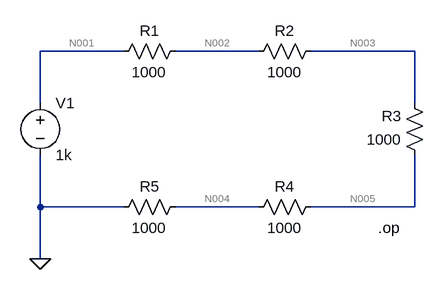
[diagram p0: schematic DC-operating-point.asc]
DC-operating-point.asc, the LTspice schematic file:
Version 4
SHEET 1 880 680
WIRE 192 32 64 32
WIRE 400 32 272 32
WIRE 640 32 480 32
WIRE 64 112 64 32
WIRE 640 112 640 32
WIRE 64 272 64 192
WIRE 192 272 64 272
WIRE 400 272 272 272
WIRE 640 272 640 192
WIRE 640 272 480 272
WIRE 64 352 64 272
FLAG 64 352 0
SYMBOL voltage 64 96 R0
SYMATTR InstName V1
SYMATTR Value 1k
SYMBOL res 288 16 R90
WINDOW 0 0 56 VBottom 2
WINDOW 3 32 56 VTop 2
SYMATTR InstName R1
SYMATTR Value 1000
SYMBOL res 496 16 R90
WINDOW 0 0 56 VBottom 2
WINDOW 3 32 56 VTop 2
SYMATTR InstName R2
SYMATTR Value 1000
SYMBOL res 656 208 R180
WINDOW 0 36 76 Left 2
WINDOW 3 36 40 Left 2
SYMATTR InstName R3
SYMATTR Value 1000
SYMBOL res 384 288 R270
WINDOW 0 32 56 VTop 2
WINDOW 3 0 56 VBottom 2
SYMATTR InstName R4
SYMATTR Value 1000
SYMBOL res 176 288 R270
WINDOW 0 32 56 VTop 2
WINDOW 3 0 56 VBottom 2
SYMATTR InstName R5
SYMATTR Value 1000
TEXT 584 304 Left 2 !.op

The netlist it stands for:
* DC-operating-point.asc
V1 N001 0 1k
R1 N002 N001 1000
R2 N003 N002 1000
R3 N005 N003 1000
R4 N004 N005 1000
R5 0 N004 1000
.op
.backanno
.end

* Results of the author's LTspice run, read from the files saved beside the schematic
* Operating Point:
*   V(n001) = 1 kV
*   V(n002) = 800 V
*   V(n003) = 600 V
*   V(n005) = 400 V
*   V(n004) = 200 V
*   I(R5) = -200 mA
*   I(R4) = -200 mA
*   I(R3) = -200 mA
*   I(R2) = -200 mA
*   I(R1) = -200 mA
*   I(V1) = -200 mA